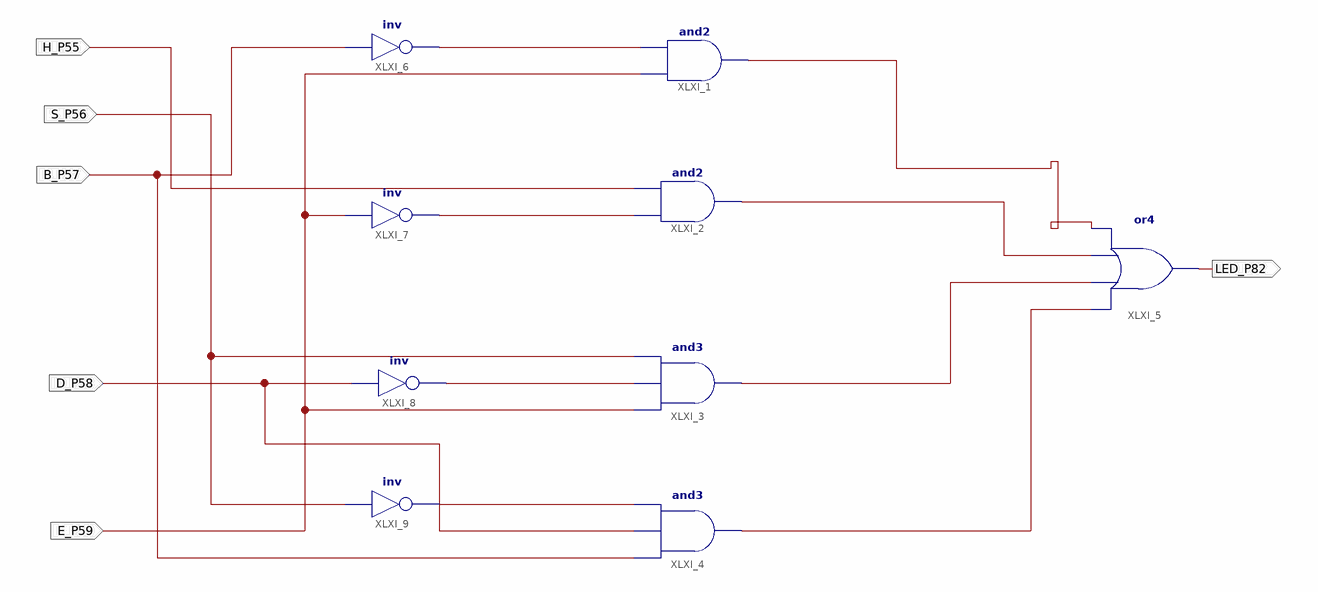
[diagram p0: schematic sheet 1]
// Xilinx ISE schematic Lab4.sch (spartan6) as structural Verilog: 9 symbols, 6 ports
module Lab4 (
  input  H_P55,
  input  E_P59,
  input  S_P56,
  input  D_P58,
  input  B_P57,
  output LED_P82
);

  wire XLXN_2, XLXN_3, XLXN_7, XLXN_9, XLXN_15, XLXN_16, XLXN_17, XLXN_18;

  and XLXI_1 (XLXN_15, E_P59, XLXN_2);
  and XLXI_2 (XLXN_16, XLXN_3, H_P55);
  and XLXI_3 (XLXN_17, E_P59, XLXN_7, S_P56);
  and XLXI_4 (XLXN_18, B_P57, D_P58, XLXN_9);
  or XLXI_5 (LED_P82, XLXN_18, XLXN_17, XLXN_16, XLXN_15);
  not XLXI_6 (XLXN_2, B_P57);
  not XLXI_7 (XLXN_3, E_P59);
  not XLXI_8 (XLXN_7, D_P58);
  not XLXI_9 (XLXN_9, S_P56);
endmodule
